# Altium schematic sheet 5V_Buck.SchDoc
size 259 x 167 mm; SheetNumber: 7; SheetTotal: 15
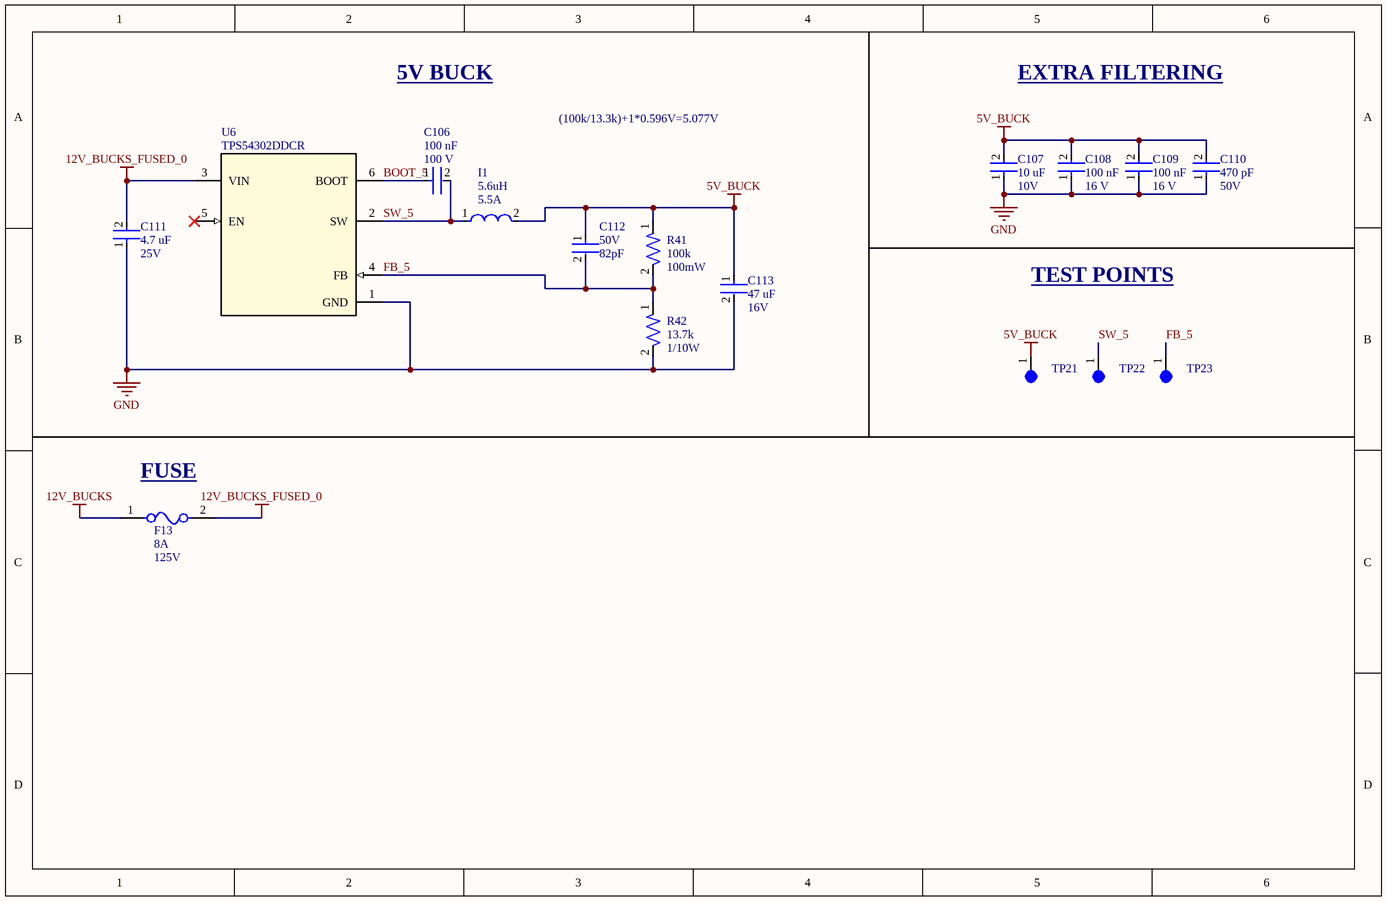
[diagram p0: 5V_Buck.SchDoc]

## Parts
C106  Capacitance: 100 nF  Voltage: 100 V  [CAP-0603]  (hidden comment: CC0603KRX7R0BB104)
C107  Voltage: 10V  Capacitance: 10 uF  [CAP-0603]  (hidden comment: CC0603KRX5R6BB106)
C108  Voltage Rating: 16 V  Capacitance: 100 nF  [CAP-0402]  (hidden comment: CC0402KRX7R7BB104)
C109  Voltage Rating: 16 V  Capacitance: 100 nF  [CAP-0402]  (hidden comment: CC0402KRX7R7BB104)
C110  Voltage: 50V  Capacitance: 470 pF  [CAP-0805]  (hidden comment: CC0805JRNPO9BN471)
C111  Capacitance: 4.7 uF  Voltage: 25V  [CAP-0603]  (hidden comment: CC0603KRX5R8BB475)
C112  Voltage: 50V  Capacitance: 82pF  [CAP-0805]  (hidden comment: CC0805JRNPO9BN820)
C113  Capacitance: 47 uF  Voltage: 16V  [CAP-1210]  (hidden comment: GRM32ER61C476KE15L)
F13  Fuse Current: 8A  Voltage Rating: 125V  [FUSE-0001]  (hidden comment: 01550900M)
I1  Saturation Current: 5.5A  Inductance: 5.6uH  [IND_SRP6540-5R6M]  (hidden comment: SRP6540-5R6M)
R41  Power: 100mW  Resistance: 100k  [RES-0603]  (hidden comment: RC0603FR-07100KL)
R42  Power: 1/10W  Resistance: 13.7k  [RES-0603]  (hidden comment: RC0603FR-0713K7L)
TP21  5003  [TEST-POINT-0001]  (value not drawn)
TP22  5003  [TEST-POINT-0001]  (value not drawn)
TP23  5003  [TEST-POINT-0001]  (value not drawn)
U6  TPS54302DDCR  [IC-SOT-23-6]

## Nets
5V_BUCK: C107.2 C108.2 C109.2 C110.2 C112.1 C113.1 I1.2 R41.1 TP21.1
12V_BUCKS: F13.1
12V_BUCKS_FUSED_0: C111.2 F13.2 U6.3(VIN)
GND: C107.1 C108.1 C109.1 C110.1 C111.1 C113.2 R42.2 U6.1(GND)
BOOT_5: C106.1 U6.6(BOOT)
FB_5: C112.2 R41.2 R42.1 TP23.1 U6.4(FB)
SW_5: C106.2 I1.1 TP22.1 U6.2(SW)

Not connected (* = marked no-connect by the designer): U6 5(EN)*

## Notes on the sheet
- 5V BUCK
- EXTRA FILTERING
- (100k/13.3k)+1*0.596V=5.077V
- TEST POINTS
- (near F13) FUSE

## Library data of the parts
C106 = CAP-100N-0001: CAP CER 0.1UF 100V X7R 0603; Device Class: Ceramic; Size: 0603; ComponentLink1Description: Datasheet; ComponentLink1URL: https://www.yageo.com/upload/media/product/app/datasheet/mlcc/upy-np0x7r_mv_100-to-630v.pdf
C107 = CAP-10U-0001: CAP CER 10UF 10V X5R 0603; ComponentLink1Description: Datasheet; ComponentLink1URL: https://www.yageo.com/upload/media/product/app/datasheet/mlcc/upy-gphc_x5r_4v-to-50v.pdf; Device Class: Ceramic; Size: 0603
C108 C109 = CAP-0.1U-0001: CAP CER 0.1UF 16V X7R 0402; ComponentLink2Description: Datasheet; ComponentLink2URL: https://www.yageo.com/upload/media/product/productsearch/datasheet/mlcc/UPY-GPHC_X7R_6.3V-to-250V_24.pdf; Device Class: Ceramic; Size: 0402
C110 = CAP-470P-0001: CAP CER 470PF 50V C0G/NPO 0805; Device Class: Ceramic; Size: 0805; ComponentLink1Description: Datasheet; ComponentLink1URL: https://www.yageo.com/upload/media/product/productsearch/datasheet/mlcc/UPY-GP_NP0_16V-to-50V_18.pdf
C111 = CAP-4.7U-0001: CAP CER 4.7UF 25V X5R 0603; Device Class: Ceramic; Size: 0603
C112 = CAP-82P-0001: 82 pF ±5% 50V Ceramic Capacitor C0G, NP0 0805 (2012 Metric)
C113 = CAP-47U-0002: CAP CER 47UF 16V X5R 1210; Device Class: Ceramic; Size: 1210; ComponentLink1Description: Datasheet; ComponentLink1URL: https://search.murata.co.jp/Ceramy/image/img/A01X/G101/ENG/GRM32ER61C476KE15-01.pdf
F13 = FUSE-0001: FUSE BLOK CARTRIDGE 125V 10A SMD; ComponentLink2Description: Datasheet; ComponentLink2URL: https://www.littelfuse.com/~/media/electronics/datasheets/fuses/littelfuse_fuse_154_154t_154l_154tl_datasheet.pdf.pdf
I1 = IND-5.6U-0002: FIXED IND 5.6UH 5.5A 38 MOHM SMD
R41 = RES-100k-0001: RES SMD 100K OHM 1% 1/10W 0603; Tolerance: 1%; Size: 0603; ComponentLink1Description: Datasheet; ComponentLink1URL: https://www.yageo.com/upload/media/product/products/datasheet/rchip/PYu-RC_Group_51_RoHS_L_12.pdf
R42 = RES-13.7K-0001: RES 13.7K OHM 1% 1/10W 0603
TP21-TP23 = TEST-POINT-0001: Oranange PC Test Point, Miniature Phoisphor Bronze Silver Plating Through Hole Mounting Type
U6 = IC-BUCK-0004: IC REG BUCK ADJ 3A SOT23